# Altium schematic sheet Block Diagram.SchDoc
size A; SheetNumber: 2; SheetTotal: 3
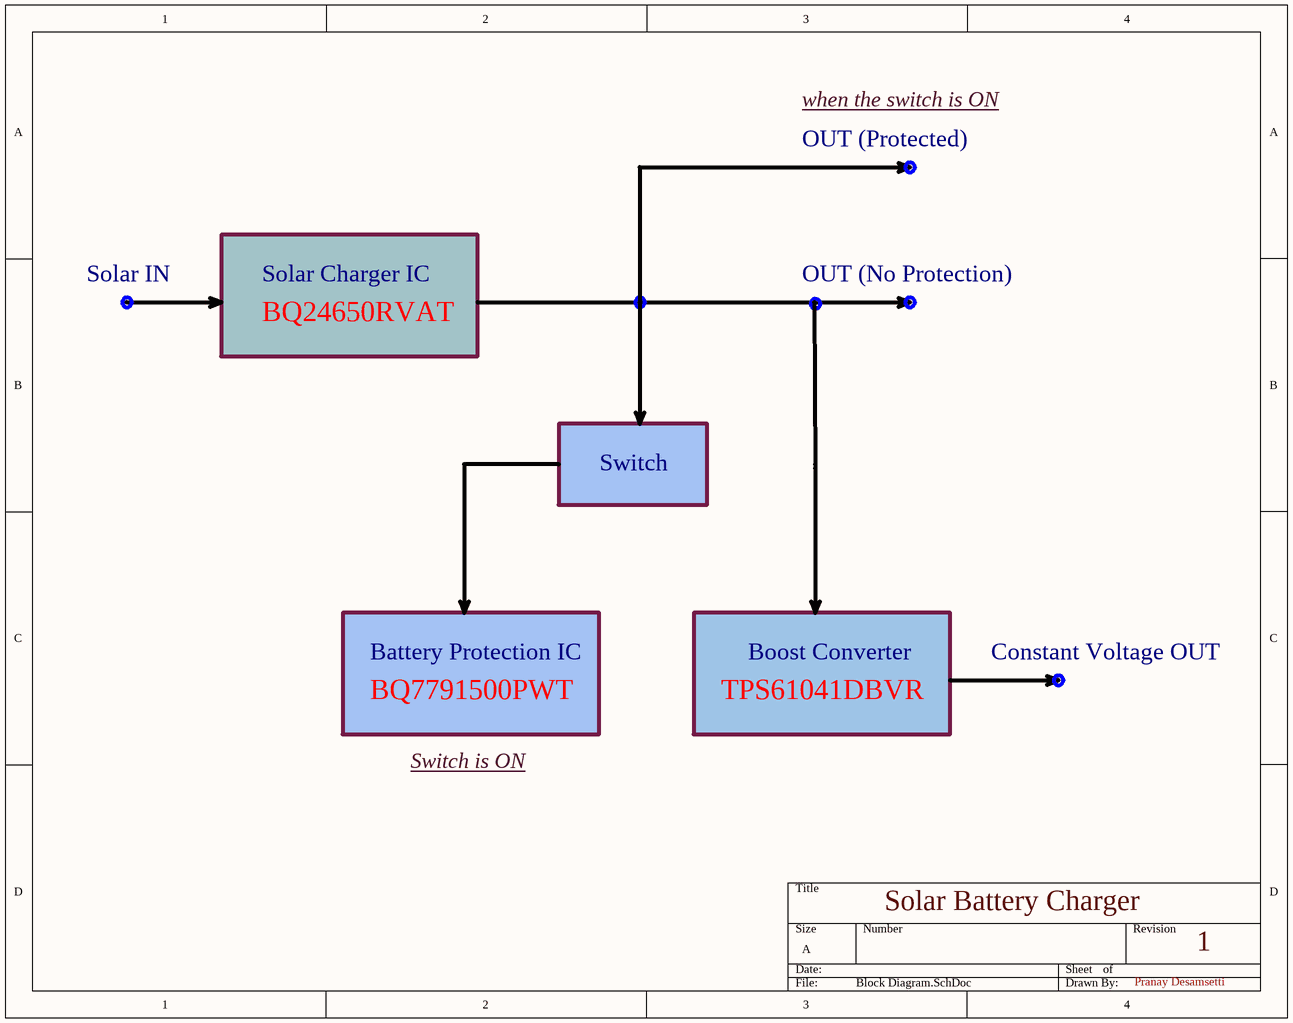
[diagram p0: Block Diagram.SchDoc]

## Notes on the sheet
- OUT (Protected)
- when the switch is ON
- Solar IN
- Solar Charger IC
- OUT (No Protection)
- BQ24650RVAT
- Switch
- Battery Protection IC
- BQ7791500PWT
- TPS61041DBVR
- Boost Converter
- Constant Voltage OUT
- Switch is ON
- Solar Battery Charger
- 1
- Pranay Desamsetti